# EAGLE schematic Amplifier (EAGLE 7.3.0)
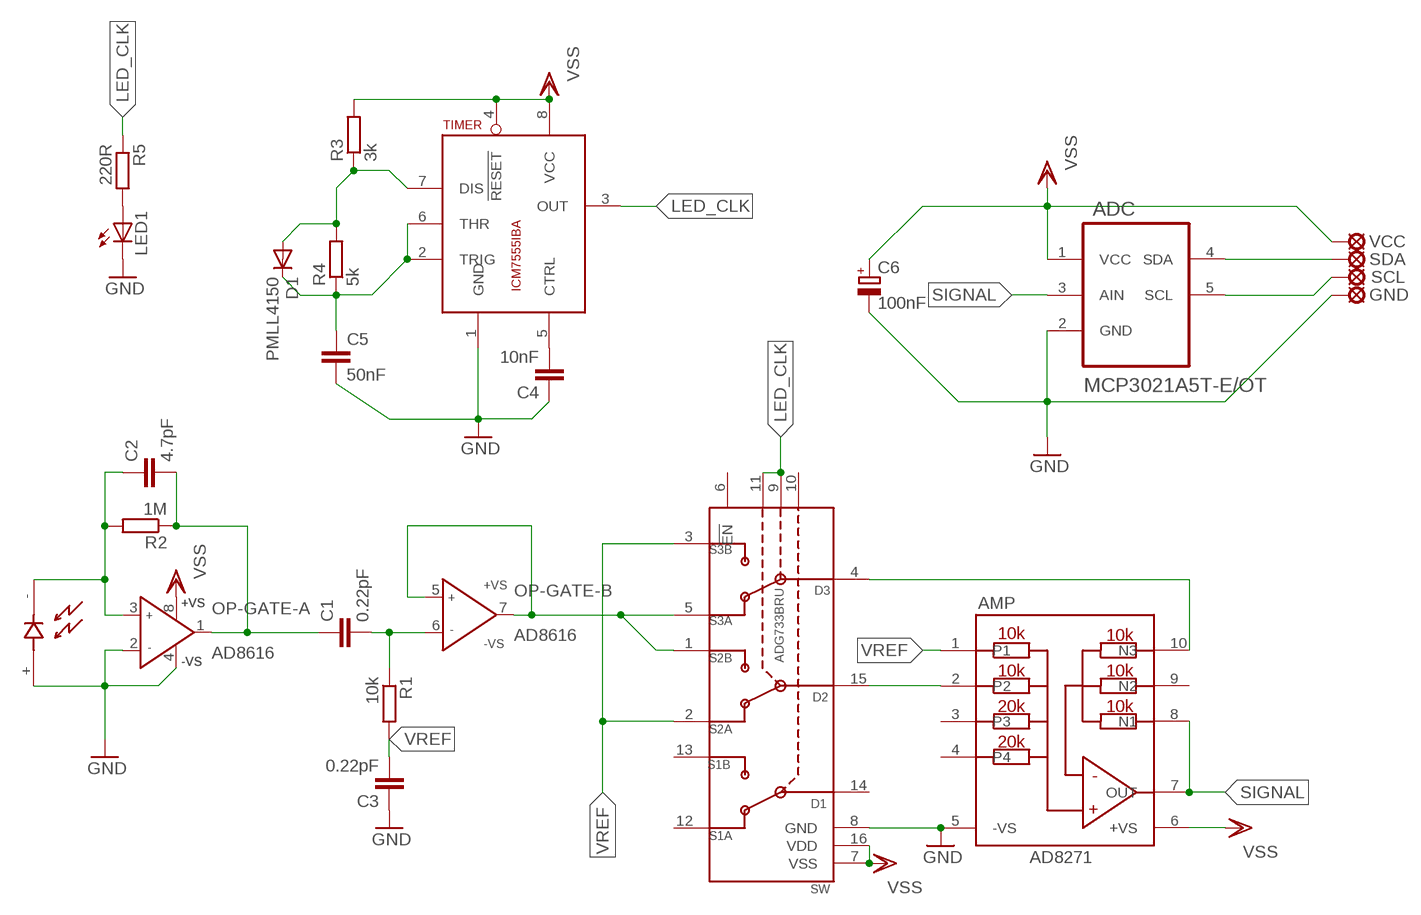
[diagram p0: schematic, sheet 1]

## Parts
ADC  MCP3021A5T-E/OT  [SOT95P270X145-5N]
AMP  AD8271  [MSOP10]
C1  0.22pF  C-EUC1206  [C1206]
C2  4.7pF  C-EUC1206  [C1206]
C3  0.22pF  C-EUC1206  [C1206]
C4  10nF  C-EUC1206  [C1206]
C5  50nF  C-EUC1206  [C1206]
C6  100nF  CPOL-EUSMCB  [SMC_B]
D1  PMLL4150  [SOD80C]
GND  LSP10  [LSP10]
LED1  LED5MM  [LED5MM]
OP-  AD8616  [MSOP08]
R1  10k  R-EU_R1206  [R1206]
R2  1M  R-EU_R1206  [R1206]
R3  3k  R-EU_R1206  [R1206]
R4  5k  R-EU_R1206  [R1206]
R5  220R  R-EU_R1206  [R1206]
SCL  LSP10  [LSP10]
SDA  LSP10  [LSP10]
SW  ADG733BRU  [TSSOP16]
TIMER  ICM7555IBA  [SOIC8]
U$1  VBT101BH  [TO-46]
VCC  LSP10  [LSP10]

## Nets
GND: ADC.2(GND) AMP.5(-VS) C3.1 C4.1 C5.2 C6.- GND.MP LED1.K(C) OP-.2(GATE-A:IN-) OP-.4(PWR:-VS) SW.8(GND) TIMER.1(GND) U$1.+
LED_CLK: SW.9(A2) SW.11(A0) TIMER.3(OUT)
N$1: OP-.5(GATE-B:IN+) OP-.7(GATE-B:OUT) SW.1(S2B) SW.5(S3A)
N$2: AMP.10(N3) SW.4(D3)
N$3: AMP.2 SW.15(D2)
N$4: ADC.5(SCL) SCL.MP
N$5: C1.2 OP-.6(GATE-B:IN-) R1.1
N$6: C1.1 C2.2 OP-.1(GATE-A:OUT) R2.1
N$7: C2.1 OP-.3(GATE-A:IN+) R2.2 U$1.-
N$8: LED1.A R5.2
N$9: C5.1 D1.C R4.1 TIMER.2(TRIG) TIMER.6(THR)
N$10: D1.A R3.1 R4.2 TIMER.7(DIS)
N$11: ADC.4(SDA) SDA.MP
N$12: C4.2 TIMER.5(CTRL)
SIGNAL: ADC.3(AIN) AMP.7(OUT) AMP.8(N1)
VREF: AMP.1 C3.2 R1.2 SW.2(S2A) SW.3(S3B)
VSS: ADC.1(VCC) AMP.6(+VS) C6.+ OP-.8(PWR:+VS) R3.2 SW.7(VSS) SW.16(VDD) TIMER.4(!RESET) TIMER.8(VCC) VCC.MP
Unconnected: AMP.3 AMP.4 AMP.9(N2) R5.1 SW.6(!EN) SW.10(A1) SW.12(S1A) SW.13(S1B) SW.14(D1)

## Library data of the parts
ADC = Arduino Dev Parts:MCP3021: A/D Converter, 10bit, I2C; MPN: MCP3021A5T-E/OT; OC_FARNELL: 1332097; OC_NEWARK: 34M7445; PACKAGE: SOT-5; SUPPLIER: Microchip
AMP = Arduino Dev Parts:AD8271
C1-C5 = rcl:C-EU: CAPACITOR, European symbol
C6 = rcl:CPOL-EU: POLARIZED CAPACITOR, European symbol
D1 = diode:PMLL4150: DIODE high speed
GND SCL SDA VCC = solpad:LSP10: SOLDER PAD drill 1.0 mm, distributor Buerklin, 12H555
LED1 = led:LED: LED OSRAM: - CHIPLED LG R971, LG N971, LY N971, LG Q971, LY Q971, LO R971, LY R971 LH N974, LH R974 LS Q976, LO Q976, LY Q976 LO Q996 - Hyper CHIPLED LW Q18S LB Q993, LB Q99A, LB R99A - SideLED LS A670, LO A670, LY A670, LG A670, LP A670 LB A673, LV A673, LT A673, LW A673 LH A674 LY A675 LS A676, LA A676, LO A676, LY A676, LW A676 LS A679, LY A679, LG A679 - Hyper Micro SIDELED® LS Y876, LA Y876, LO Y876, LY Y876 LT Y87S - SmartLED LW L88C, LW L88S LB L89C, LB L89S, LG L890 LS L89K, LO L89K, LY L89K LS L896, LA L896, LO L896, LY L896 - TOPLED LS T670, LO T670, LY T670, LG T670, LP T670 LSG T670, LSP T670, LSY T670, LOP T670, LYG T670 LG T671, LOG T671, LSG T671 LB T673, LV T673, LT T673, LW T673 LH T674 LS T676, LA T676, LO T676, LY T676, LB T676, LH T676, LSB T676, LW T676 LB T67C, LV T67C, LT T67C, LS T67K, LO T67K, LY T67K, LW E67C LS E67B, LA E67B, LO E67B, LY E67B, LB E67C, LV E67C, LT E67C LW T67C LS T679, LY T679, LG T679 LS T770, LO T770, LY T770, LG T770, LP T770 LB T773, LV T773, LT T773, LW T773 LH T774 LS E675, LA E675, LY E675, LS T675 LS T776, LA T776, LO T776, LY T776, LB T776 LHGB T686 LT T68C, LB T68C - Hyper Mini TOPLED® LB M676 - Mini TOPLED Santana® LG M470 LS M47K, LO M47K, LY M47K Source: http://www.osram.convergy.de LUXEON: - LUMILED® LXK2-PW12-R00, LXK2-PW12-S00, LXK2-PW14-U00, LXK2-PW14-V00 LXK2-PM12-R00, LXK2-PM12-S00, LXK2-PM14-U00 LXK2-PE12-Q00, LXK2-PE12-R00, LXK2-PE12-S00, LXK2-PE14-T00, LXK2-PE14-U00 LXK2-PB12-K00, LXK2-PB12-L00, LXK2-PB12-M00, LXK2-PB14-N00, LXK2-PB14-P00, LXK2-PB14-Q00 LXK2-PR12-L00, LXK2-PR12-M00, LXK2-PR14-Q00, LXK2-PR14-R00 LXK2-PD12-Q00, LXK2-PD12-R00, LXK2-PD12-S00 LXK2-PH12-R00, LXK2-PH12-S00 LXK2-PL12-P00, LXK2-PL12-Q00, LXK2-PL12-R00 Source: www.luxeon.com KINGBRIGHT: KA-3528ASYC Source: www.kingbright.com
OP- = Arduino Dev Parts:AD8616
R1-R5 = rcl:R-EU_: RESISTOR, European symbol
SW = Arduino Dev Parts:ADG733; MF: ANALOG DEVICES; MPN: ADG733BRUZ; OC_FARNELL: 2102516
TIMER = Arduino Dev Parts:ICM7555; MF: INTERSIL; MPN: ICM7555IBAZ; OC_FARNELL: 9663754
U$1 = Arduino Dev Parts:VBT101BH: Phododiode VBT1013BH 580nm peak, 330-720nm range